# EAGLE design Slave (EAGLE 9.5.1)
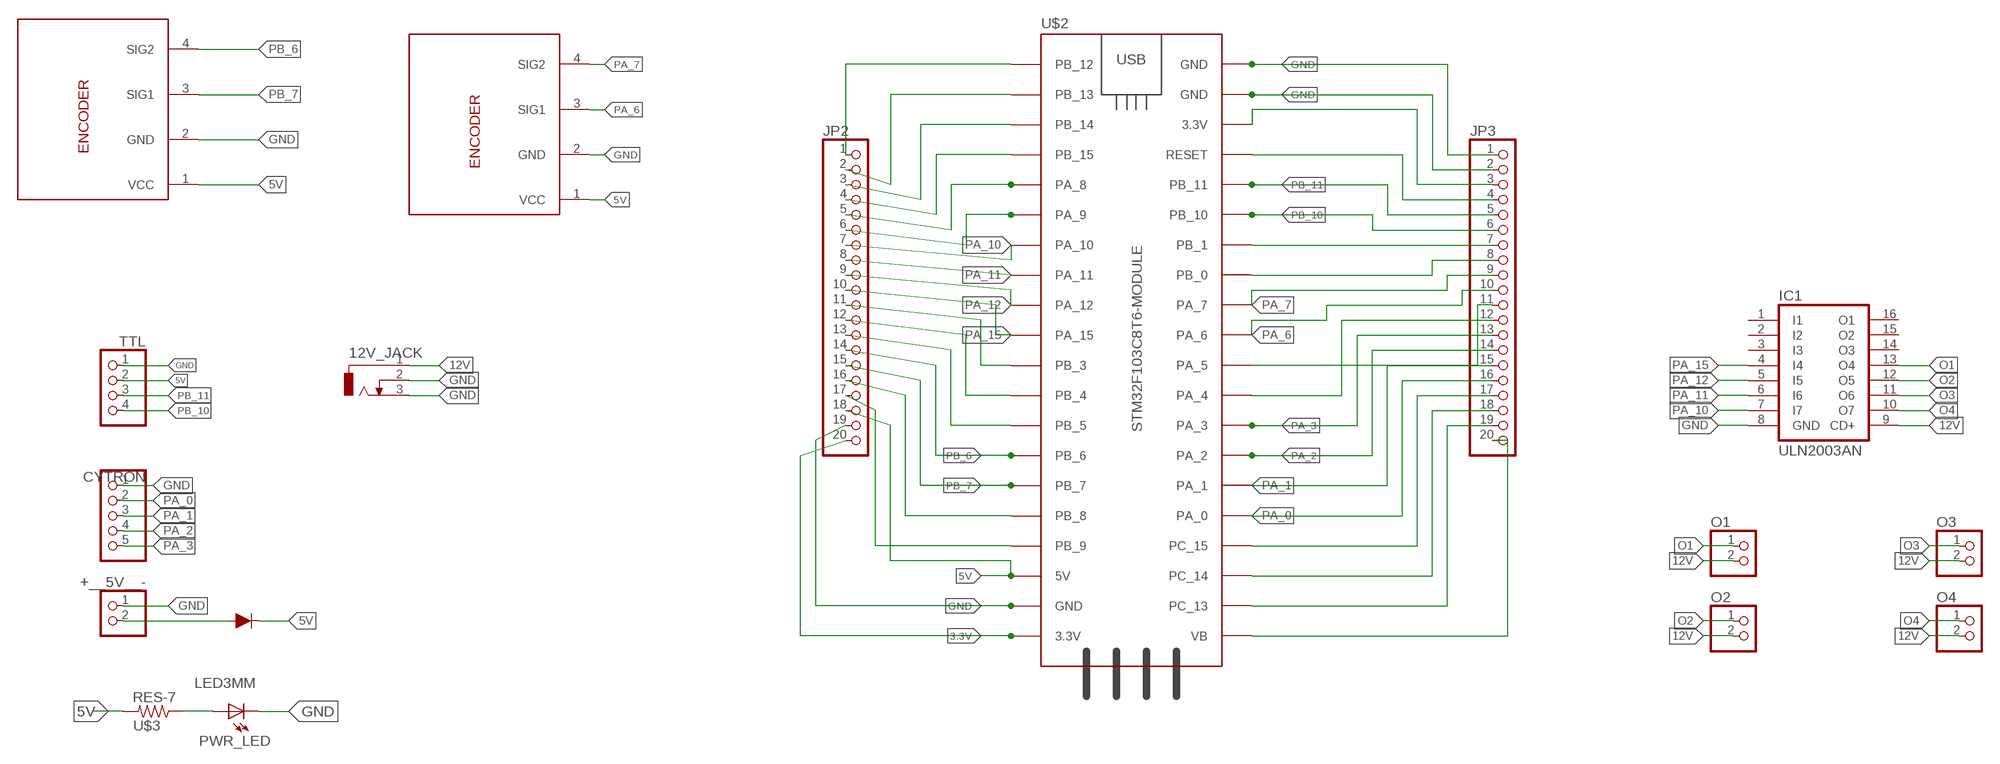
[diagram p0: schematic, sheet 1]

## Parts
12V_JACK  CON_JACK  [DCJ0303]
+__5V__-  PINHD-2_DATA  [1X02_DATA]
CYTRON  PINHD-5_DATA  [1X05_DATA]
D1  200mA/100V/1V  DIODE(1A)-1N4148  [DIODE-1N4148]
IC1  ULN2003AN  [DIL16]
JP2  PINHD-1X20  [1X20]
JP3  PINHD-1X20  [1X20]
O1  PINHD-2_DATA  [1X02_DATA]
O2  PINHD-2_DATA  [1X02_DATA]
O3  PINHD-2_DATA  [1X02_DATA]
O4  PINHD-2_DATA  [1X02_DATA]
PWR_LED  LED3MM  [LED3MM]
TTL  PINHD-4_DATA  [1X04_DATA]
U$1  ENCODER  [1X04_DATA]
U$2  STM32F103C8T6-MODULE  [STM32F103C8T6-MODULE]
U$3  RES-7  [0204/7]
U$5  ENCODER  [1X04_DATA]

## Nets
3.3V: JP2.20 U$2.3.3V_1(3.3V)
5V: D1.C JP2.18 TTL.2 U$1.1(VCC) U$2.5V U$3.2 U$5.1(VCC)
12V: 12V_JACK.1 IC1.9(CD+) O1.2 O2.2 O3.2 O4.2
A: PWR_LED.A U$3.1
GND: 12V_JACK.2 12V_JACK.3 +__5V__-.1 CYTRON.1 IC1.8(GND) JP2.19 JP3.1 JP3.2 PWR_LED.K(C) TTL.1 U$1.2(GND) U$2.GND_1(GND) U$2.GND_2(GND) U$2.GND_3(GND) U$5.2(GND)
N$1: JP3.20 U$2.VB
N$3: JP3.19 U$2.PC_13
N$4: JP3.18 U$2.PC_14
N$5: JP3.17 U$2.PC_15
N$8: JP3.12 U$2.PA_4
N$9: JP3.3 U$2.3.3V_2(3.3V)
N$10: JP3.4 U$2.RESET
N$11: JP3.7 U$2.PB_1
N$12: JP3.8 U$2.PB_0
N$15: JP3.11 U$2.PA_5
N$16: JP2.1 U$2.PB_12
N$17: JP2.2 U$2.PB_13
N$18: JP2.3 U$2.PB_14
N$19: JP2.4 U$2.PB_15
N$24: JP2.11 U$2.PB_3
N$25: JP2.12 U$2.PB_4
N$26: JP2.13 U$2.PB_5
N$27: JP2.16 U$2.PB_8
N$28: JP2.17 U$2.PB_9
N$29: +__5V__-.2 D1.A
O1: IC1.13(O4) O1.1
O2: IC1.12(O5) O2.1
O3: IC1.11(O6) O3.1
O4: IC1.10(O7) O4.1
PA_0: CYTRON.2 JP3.16 U$2.PA_0
PA_1: CYTRON.3 JP3.15 U$2.PA_1
PA_2: CYTRON.4 JP3.14 U$2.PA_2
PA_3: CYTRON.5 JP3.13 U$2.PA_3
PA_6: JP3.10 U$1.3(SIG1) U$2.PA_6
PA_7: JP3.9 U$1.4(SIG2) U$2.PA_7
PA_8: JP2.5 U$2.PA_8
PA_9: JP2.6 U$2.PA_9
PA_10: IC1.7(I7) JP2.7 U$2.PA_10
PA_11: IC1.6(I6) JP2.8 U$2.PA_11
PA_12: IC1.5(I5) JP2.9 U$2.PA_12
PA_15: IC1.4(I4) JP2.10 U$2.PA_15
PB_6: JP2.14 U$2.PB_6 U$5.4(SIG2)
PB_7: JP2.15 U$2.PB_7 U$5.3(SIG1)
PB_10: JP3.6 TTL.4 U$2.PB_10
PB_11: JP3.5 TTL.3 U$2.PB_11
Unconnected: IC1.1(I1) IC1.2(I2) IC1.3(I3) IC1.14(O3) IC1.15(O2) IC1.16(O1)

## Library data of the parts
12V_JACK = MIA_LIBRARY-2-2-2:CON_JACK: DC POWER JACK Source: DCJ0303.pdf; OC_FARNELL: unknown; OC_NEWARK: unknown
+__5V__- O1-O4 = MIA_LIBRARY-2-2-2:PINHD-2_DATA: PIN HEADER
CYTRON = MIA_LIBRARY-2-2-2:PINHD-5_DATA: PIN HEADER
D1 = MIA_LIBRARY-2-2-2:DIODE(1A): Diode These are standard reverse protection diodes and small signal diodes. SparkFun Products: SparkFun SparkPunk Sound Kit <https://www.sparkfun.com/products/11177> SparkFun ESP8266 Thing <https://www.sparkfun.com/products/13231>; PROD_ID: DIO-08378
IC1 = MIA_LIBRARY-2-2-2:ULN2003A: DRIVER ARRAY
JP2 JP3 = MIA_LIBRARY-2-2-2:PINHD-1X20: PIN HEADER
PWR_LED = MIA_LIBRARY-2-2-2:LED3MM
TTL = MIA_LIBRARY-2-2-2:PINHD-4_DATA: PIN HEADER
U$1 U$5 = MIA_LIBRARY-2-2-2:ENCODER
U$2 = MIA_LIBRARY-2-2-2:STM32F103C8T6-MODULE: STM32F103C8T6 module with ARM Cortex-3, 20kB SRAM, 64kB Flash, 72MHz
U$3 = MIA_LIBRARY-2-2-2:RES-7

## Board
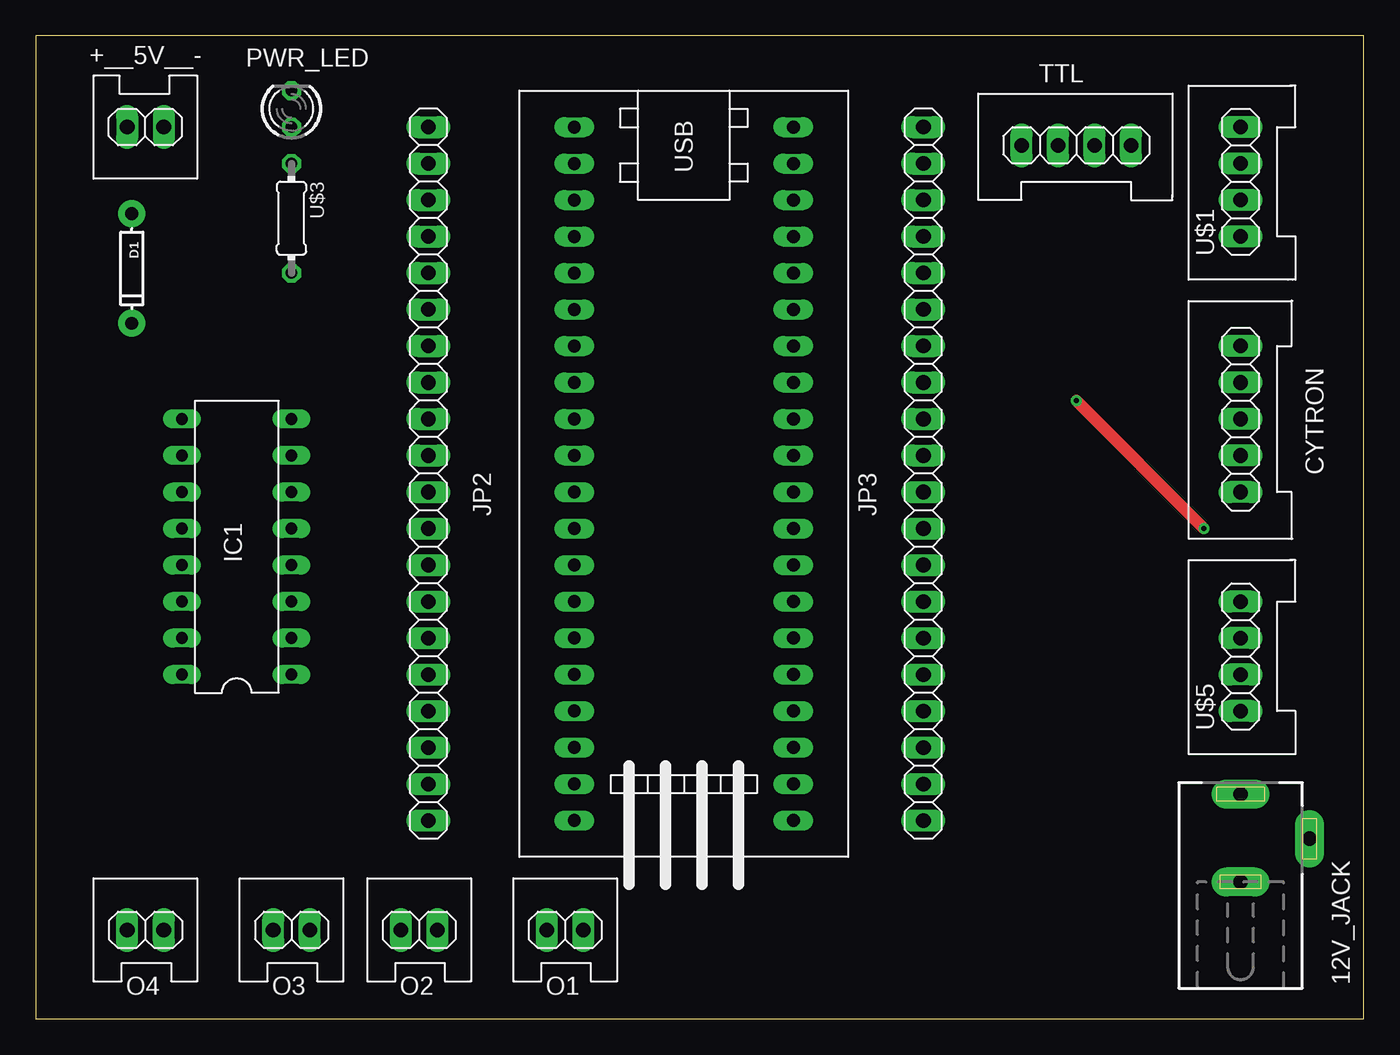
[diagram p1: board, top side]
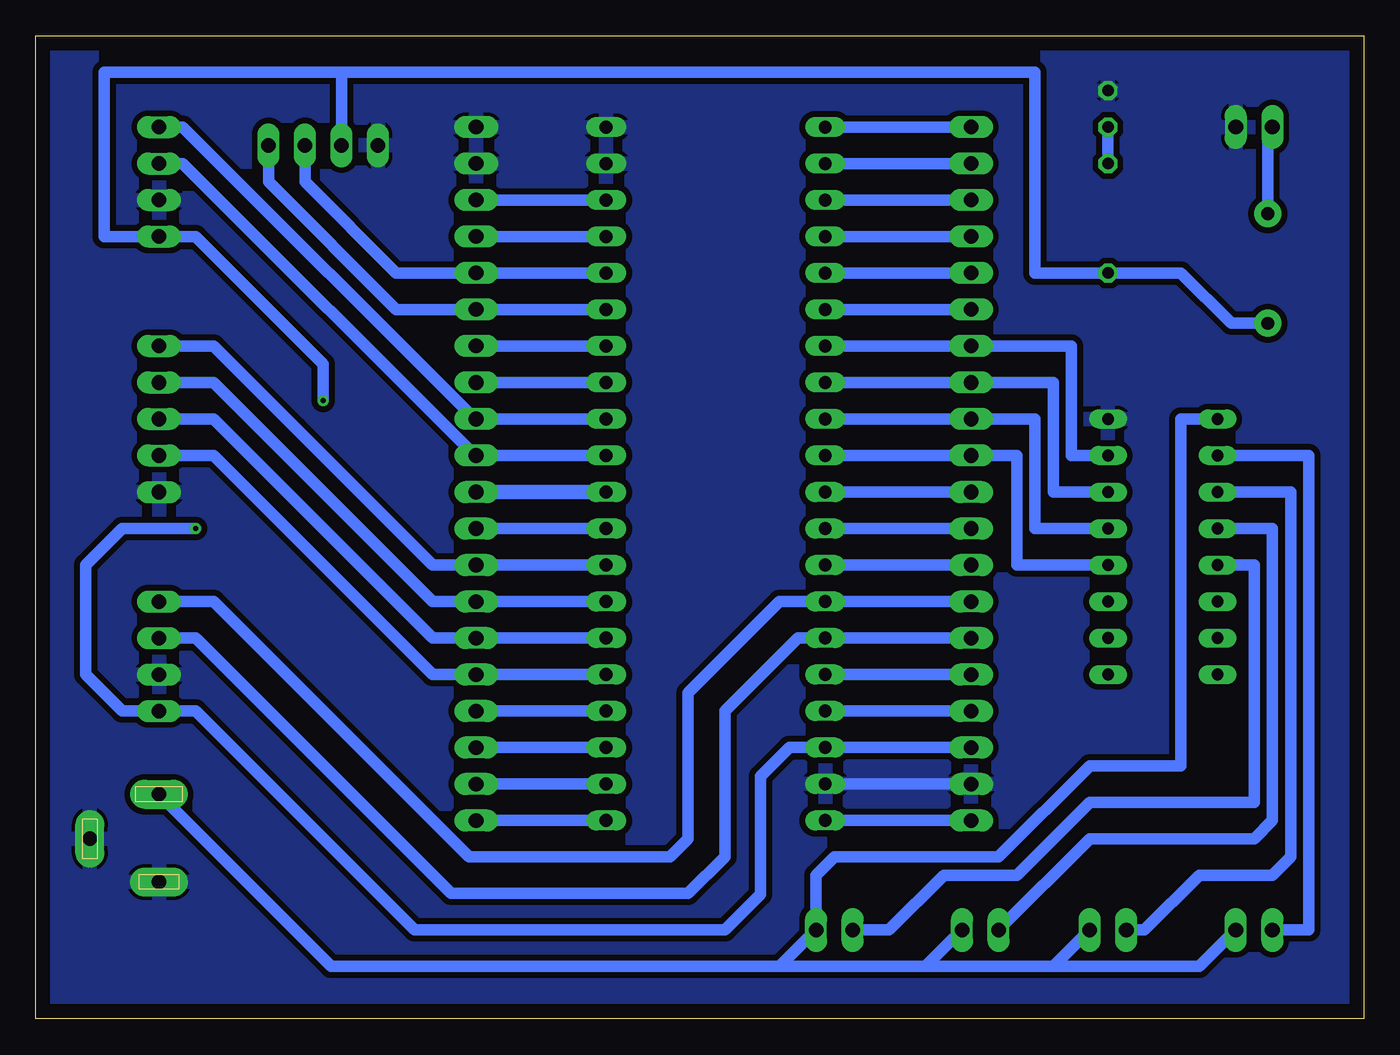
[diagram p2: board, bottom side, seen from below]

Size 92.38 x 68.41 mm. Coordinates in mm from the lower left corner, seen from the top.
Outline: 0,0 92.38,0 92.38,68.41 0,68.41 0,0
Copper layers (1*16): Top 0.035mm / dielectric 1.5mm / Bottom 0.035mm
Design rules "default": minimum track width 6mil, minimum drill 0.35mm, track to track 6mil, track to pad 6mil, pad to pad 6mil, via to via 6mil, smd to smd 6mil, copper to edge 40mil, drill to drill 6mil, minimum pad ring 10mil, minimum via ring 8mil, stop-mask expansion 4mil, vias tented up to drill 0mil, thermal gap 10mil

### Footprints (pad centres in the part's own frame; a part is rotated, then mirrored left to right if it is on the bottom)
DCJ0303 = drill 1 pad 2 long: 1 0,3.1; 2 4.8,0; 3 0,-3
1X02_DATA = drill 1.016 long: 1 -1.27,0; 2 1.27,0
1X05_DATA = drill 1.016 long: 1 -5.08,0; 2 -2.54,0; 3 0,0; 4 2.54,0; 5 5.08,0
DIODE-1N4148 = drill 0.9 pad 1.88: A -3.81,0; C 3.81,0
DIL16 = drill 0.813 long: 1 -8.89,-3.81; 2 -6.35,-3.81; 3 -3.81,-3.81; 4 -1.27,-3.81; 5 1.27,-3.81; 6 3.81,-3.81; 7 6.35,-3.81; 8 8.89,-3.81; 9 8.89,3.81; 10 6.35,3.81; 11 3.81,3.81; 12 1.27,3.81; 13 -1.27,3.81; 14 -3.81,3.81; 15 -6.35,3.81; 16 -8.89,3.81
1X20 = drill 1.016 long: 1 -24.13,0; 2 -21.59,0; 3 -19.05,0; 4 -16.51,0; 5 -13.97,0; 6 -11.43,0; 7 -8.89,0; 8 -6.35,0; 9 -3.81,0; 10 -1.27,0; 11 1.27,0; 12 3.81,0; 13 6.35,0; 14 8.89,0; 15 11.43,0; 16 13.97,0; 17 16.51,0; 18 19.05,0; 19 21.59,0; 20 24.13,0
LED3MM = drill 0.813 octagon: A -1.27,0; K 1.27,0
1X04_DATA = drill 1.016 long: 1 -3.81,0; 2 -1.27,0; 3 1.27,0; 4 3.81,0
STM32F103C8T6-MODULE = drill 0.9 long: 3.3V_1 25.4,-7.62; 3.3V_2 -17.78,7.62; 5V 20.32,-7.62; GND_1 22.86,-7.62; GND_2 -20.32,7.62; GND_3 -22.86,7.62; PA_0 15.24,7.62; PA_1 12.7,7.62; PA_2 10.16,7.62; PA_3 7.62,7.62; PA_4 5.08,7.62; PA_5 2.54,7.62; PA_6 0,7.62; PA_7 -2.54,7.62; PA_8 -12.7,-7.62; PA_9 -10.16,-7.62; PA_10 -7.62,-7.62; PA_11 -5.08,-7.62; PA_12 -2.54,-7.62; PA_15 0,-7.62; PB_0 -5.08,7.62; PB_1 -7.62,7.62; PB_3 2.54,-7.62; PB_4 5.08,-7.62; PB_5 7.62,-7.62; PB_6 10.16,-7.62; PB_7 12.7,-7.62; PB_8 15.24,-7.62; PB_9 17.78,-7.62; PB_10 -10.16,7.62; PB_11 -12.7,7.62; PB_12 -22.86,-7.62; PB_13 -20.32,-7.62; PB_14 -17.78,-7.62; PB_15 -15.24,-7.62; PC_13 22.86,7.62; PC_14 20.32,7.62; PC_15 17.78,7.62; RESET -15.24,7.62; VB 25.4,7.62
0204/7 = drill 0.813 octagon: 1 -3.81,0; 2 3.81,0

### Placement (x,y rotation side)
12V_JACK  83.82,12.54 0 top
+__5V__-  7.62,62.07 180 top
CYTRON  83.82,41.75 90 top
D1  6.67,52.22 270 top
IC1  13.97,32.86 90 top
JP2  27.31,37.94 270 top
JP3  61.75,37.94 270 top
O1  36.83,6.19 0 top
O2  26.67,6.19 0 top
O3  17.78,6.19 0 top
O4  7.62,6.19 0 top
PWR_LED  17.78,63.34 90 top
TTL  72.39,60.8 0 top
U$1  83.82,58.26 90 top
U$2  45.08,39.21 270 top
U$3  17.78,55.72 270 top
U$5  83.82,25.24 90 top

### Tracks (layer width: path | path; a pad name or v marks a point on that pad's centre or on a via)
3.3V
  Bottom 0.813: U$2.3.3V_1 JP2.20
5V  (via drill 0.35)
  Top 0.813: v72.39,43.02 v81.28,34.13
  Bottom 0.813: JP2.18 U$2.5V 39.95,18.89 41.97,16.87 41.97,8.67 44.45,6.19 66.04,6.19 81.28,21.43 U$5.1 86.36,21.43 88.9,23.97 88.9,31.59 86.36,34.13 v81.28,34.13 | D1.C 9.2,48.41 12.7,51.91 U$3.2 22.86,51.91 22.86,65.88 71.12,65.88 | 71.12,65.88 87.63,65.88 87.63,54.45 U$1.1 81.28,54.45 72.39,45.56 v72.39,43.02 | 71.12,65.88 TTL.2
12V
  Bottom 0.813: 12V_JACK.1 71.83,3.65 40.64,3.65 | 40.64,3.65 O1.2 38.1,10 36.83,11.27 25.4,11.27 19.05,17.62 12.7,17.62 12.7,41.75 IC1.9 | 40.64,3.65 30.48,3.65 | O2.2 30.48,3.65 | 30.48,3.65 21.59,3.65 | 21.59,3.65 O3.2 | 21.59,3.65 11.43,3.65 O4.2
A
  Bottom 0.813: U$3.1 PWR_LED.A
GND
  Bottom 0.813: U$2.GND_1 JP2.19
  pour Bottom (isolate 0.406): 0,68.42 92.71,68.42 92.71,-0.16 0,-0.16
N$1
  Bottom 0.813: JP3.20 U$2.VB
N$3
  Bottom 0.813: JP3.19 U$2.PC_13
N$4
  Bottom 0.813: JP3.18 U$2.PC_14
N$5
  Bottom 0.813: JP3.17 U$2.PC_15
N$8
  Bottom 0.813: JP3.12 U$2.PA_4
N$9
  Bottom 0.813: JP3.3 U$2.3.3V_2
N$10
  Bottom 0.813: JP3.4 U$2.RESET
N$11
  Bottom 0.813: JP3.7 U$2.PB_1
N$12
  Bottom 0.813: JP3.8 U$2.PB_0
N$15
  Bottom 1.016: JP3.11 U$2.PA_5
N$16
  Bottom 0.813: U$2.PB_12 JP2.1
N$17
  Bottom 0.813: U$2.PB_13 JP2.2
N$18
  Bottom 0.813: U$2.PB_14 JP2.3
N$19
  Bottom 0.813: U$2.PB_15 JP2.4
N$24
  Bottom 0.813: U$2.PB_3 JP2.11
N$25
  Bottom 0.813: U$2.PB_4 JP2.12
N$26
  Bottom 0.813: U$2.PB_5 JP2.13
N$27
  Bottom 0.813: U$2.PB_8 JP2.16
N$28
  Bottom 0.813: U$2.PB_9 JP2.17
N$29
  Bottom 0.813: +__5V__-.2 6.67,62.07 D1.A
O1
  Bottom 0.813: O1.1 33.02,6.19 29.21,10 24.13,10 19.05,15.08 7.62,15.08 7.62,31.59 IC1.13
O2
  Bottom 0.813: IC1.12 6.35,34.13 6.35,13.81 7.62,12.54 19.05,12.54 O2.1
O3
  Bottom 0.813: IC1.11 5.08,36.67 5.08,11.27 6.35,10 11.43,10 15.24,6.19 O3.1
O4
  Bottom 0.813: IC1.10 3.81,39.21 3.81,6.19 O4.1
PA_0
  Bottom 0.813: U$2.PA_0 JP3.16 64.77,23.97 80.01,39.21 CYTRON.2
PA_1
  Bottom 0.813: U$2.PA_1 JP3.15 64.77,26.51 80.01,41.75 CYTRON.3
PA_2
  Bottom 0.813: U$2.PA_2 JP3.14 64.77,29.05 80.01,44.29 CYTRON.4
PA_3
  Bottom 0.813: U$2.PA_3 JP3.13 64.77,31.59 80.01,46.83 CYTRON.5
PA_6
  Bottom 0.813: U$2.PA_6 JP3.10 61.84,39.21 82.16,59.53 U$1.3
PA_7
  Bottom 0.813: U$2.PA_7 JP3.9 61.8,41.7 82.16,62.07 U$1.4
PA_8
  Bottom 0.813: U$2.PA_8 JP2.5
PA_9
  Bottom 0.813: U$2.PA_9 JP2.6
PA_10
  Bottom 0.813: U$2.PA_10 JP2.7 20.32,46.83 20.32,39.21 IC1.7
PA_11
  Bottom 0.813: U$2.PA_11 JP2.8 21.59,44.29 21.59,36.67 IC1.6
PA_12
  Bottom 0.813: U$2.PA_12 JP2.9 22.86,41.75 22.86,34.13 IC1.5
PA_15
  Bottom 0.813: U$2.PA_15 JP2.10 24.13,39.21 24.13,31.59 IC1.4
PB_6
  Bottom 0.813: JP2.14 U$2.PB_6 40.64,29.05 46.99,22.7 46.99,12.54 48.26,11.27 62.23,11.27 80.01,29.05 U$5.4
PB_7
  Bottom 0.813: JP2.15 U$2.PB_7 39.37,26.51 44.45,21.43 44.45,11.27 46.99,8.73 63.5,8.73 81.28,26.51 U$5.3
PB_10
  Bottom 0.813: U$2.PB_10 JP3.6 67.31,49.37 76.2,58.26 TTL.4
PB_11
  Bottom 0.813: U$2.PB_11 JP3.5 67.31,51.91 73.66,58.26 TTL.3